# EAGLE schematic CPU (EAGLE 4.14)
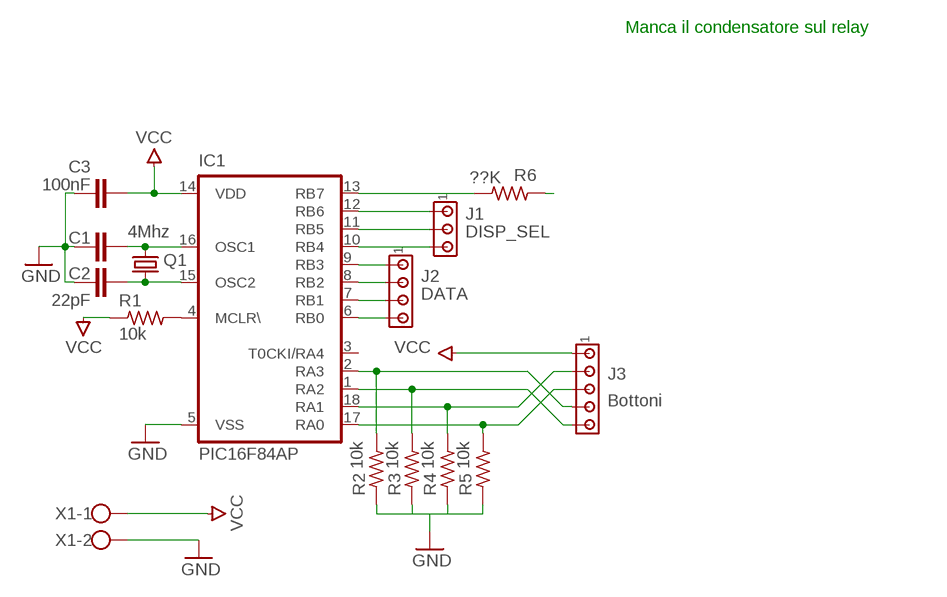
[diagram p0: schematic, sheet 1]

## Parts
C1  C5/2.5  [C5B2.5]
C2  22pF  C5/2.5  [C5B2.5]
C3  100nF  C5/2.5  [C5B2.5]
IC1  PIC16F84AP  [DIL18]
J1  DISP_SEL  MTA03-100  [10X03MTA]
J2  DATA  MTA04-100  [10X04MTA]
J3  Bottoni  MTA05-100  [10X05MTA]
Q1  4Mhz  CRYTALHC49S  [HC49/S]
R1  10k  R_X0207/12  [0207/12]
R2  10k  R_X0207/12  [0207/12]
R3  10k  R_X0207/12  [0207/12]
R4  10k  R_X0207/12  [0207/12]
R5  10k  R_X0207/12  [0207/12]
R6  ??K  R_X0207/12  [0207/12]
X1  AK500/2  [AK500/2]

## Nets
GND: C1.1 C2.1 C3.1 IC1.5(VSS) R2.1 R3.1 R4.1 R5.1 X1.2
N$1: IC1.4(MCLR\) R1.2
N$2: C1.2 IC1.16(OSC1) Q1.1
N$3: C2.2 IC1.15(OSC2) Q1.2
N$4: IC1.6(RB0) J2.4
N$5: IC1.7(RB1) J2.3
N$6: IC1.8(RB2) J2.2
N$7: IC1.9(RB3) J2.1
N$8: IC1.10(RB4) J1.3
N$9: IC1.11(RB5) J1.2
N$10: IC1.12(RB6) J1.1
N$11: IC1.13(RB7) R6.2
N$12: IC1.17(RA0) J3.3 R5.2
N$13: IC1.18(RA1) J3.2 R4.2
N$14: IC1.1(RA2) J3.5 R3.2
N$15: IC1.2(RA3) J3.4 R2.2
N$16: R6.1
VCC: C3.2 IC1.14(VDD) J3.1 R1.1 X1.1
Unconnected: IC1.3(T0CKI/RA4)

## Notes on the sheet
- Manca il condensatore sul relay

## Library data of the parts
C1-C3 = capacitor-wima:C: CAPACITOR naming: grid - package width
IC1 = microchip:PIC16F8*: MICROCONTROLLER 8-Bit PIC16F8X Family - CMOS Flash/EEPROM Pin Compatible : PIC16F83, PIC16CR83, PIC16F84A, PIC16CR84 see also PIC16C*
J1 = con-amp:MTA03-100: AMP connector
J2 = con-amp:MTA04-100: AMP connector
J3 = con-amp:MTA05-100: AMP connector
Q1 = crystal:CRYTAL: CRYSTAL
R1-R6 = rc-master:R_: RESISTOR
X1 = con-ptr500+:AK500/2: CONNECTOR